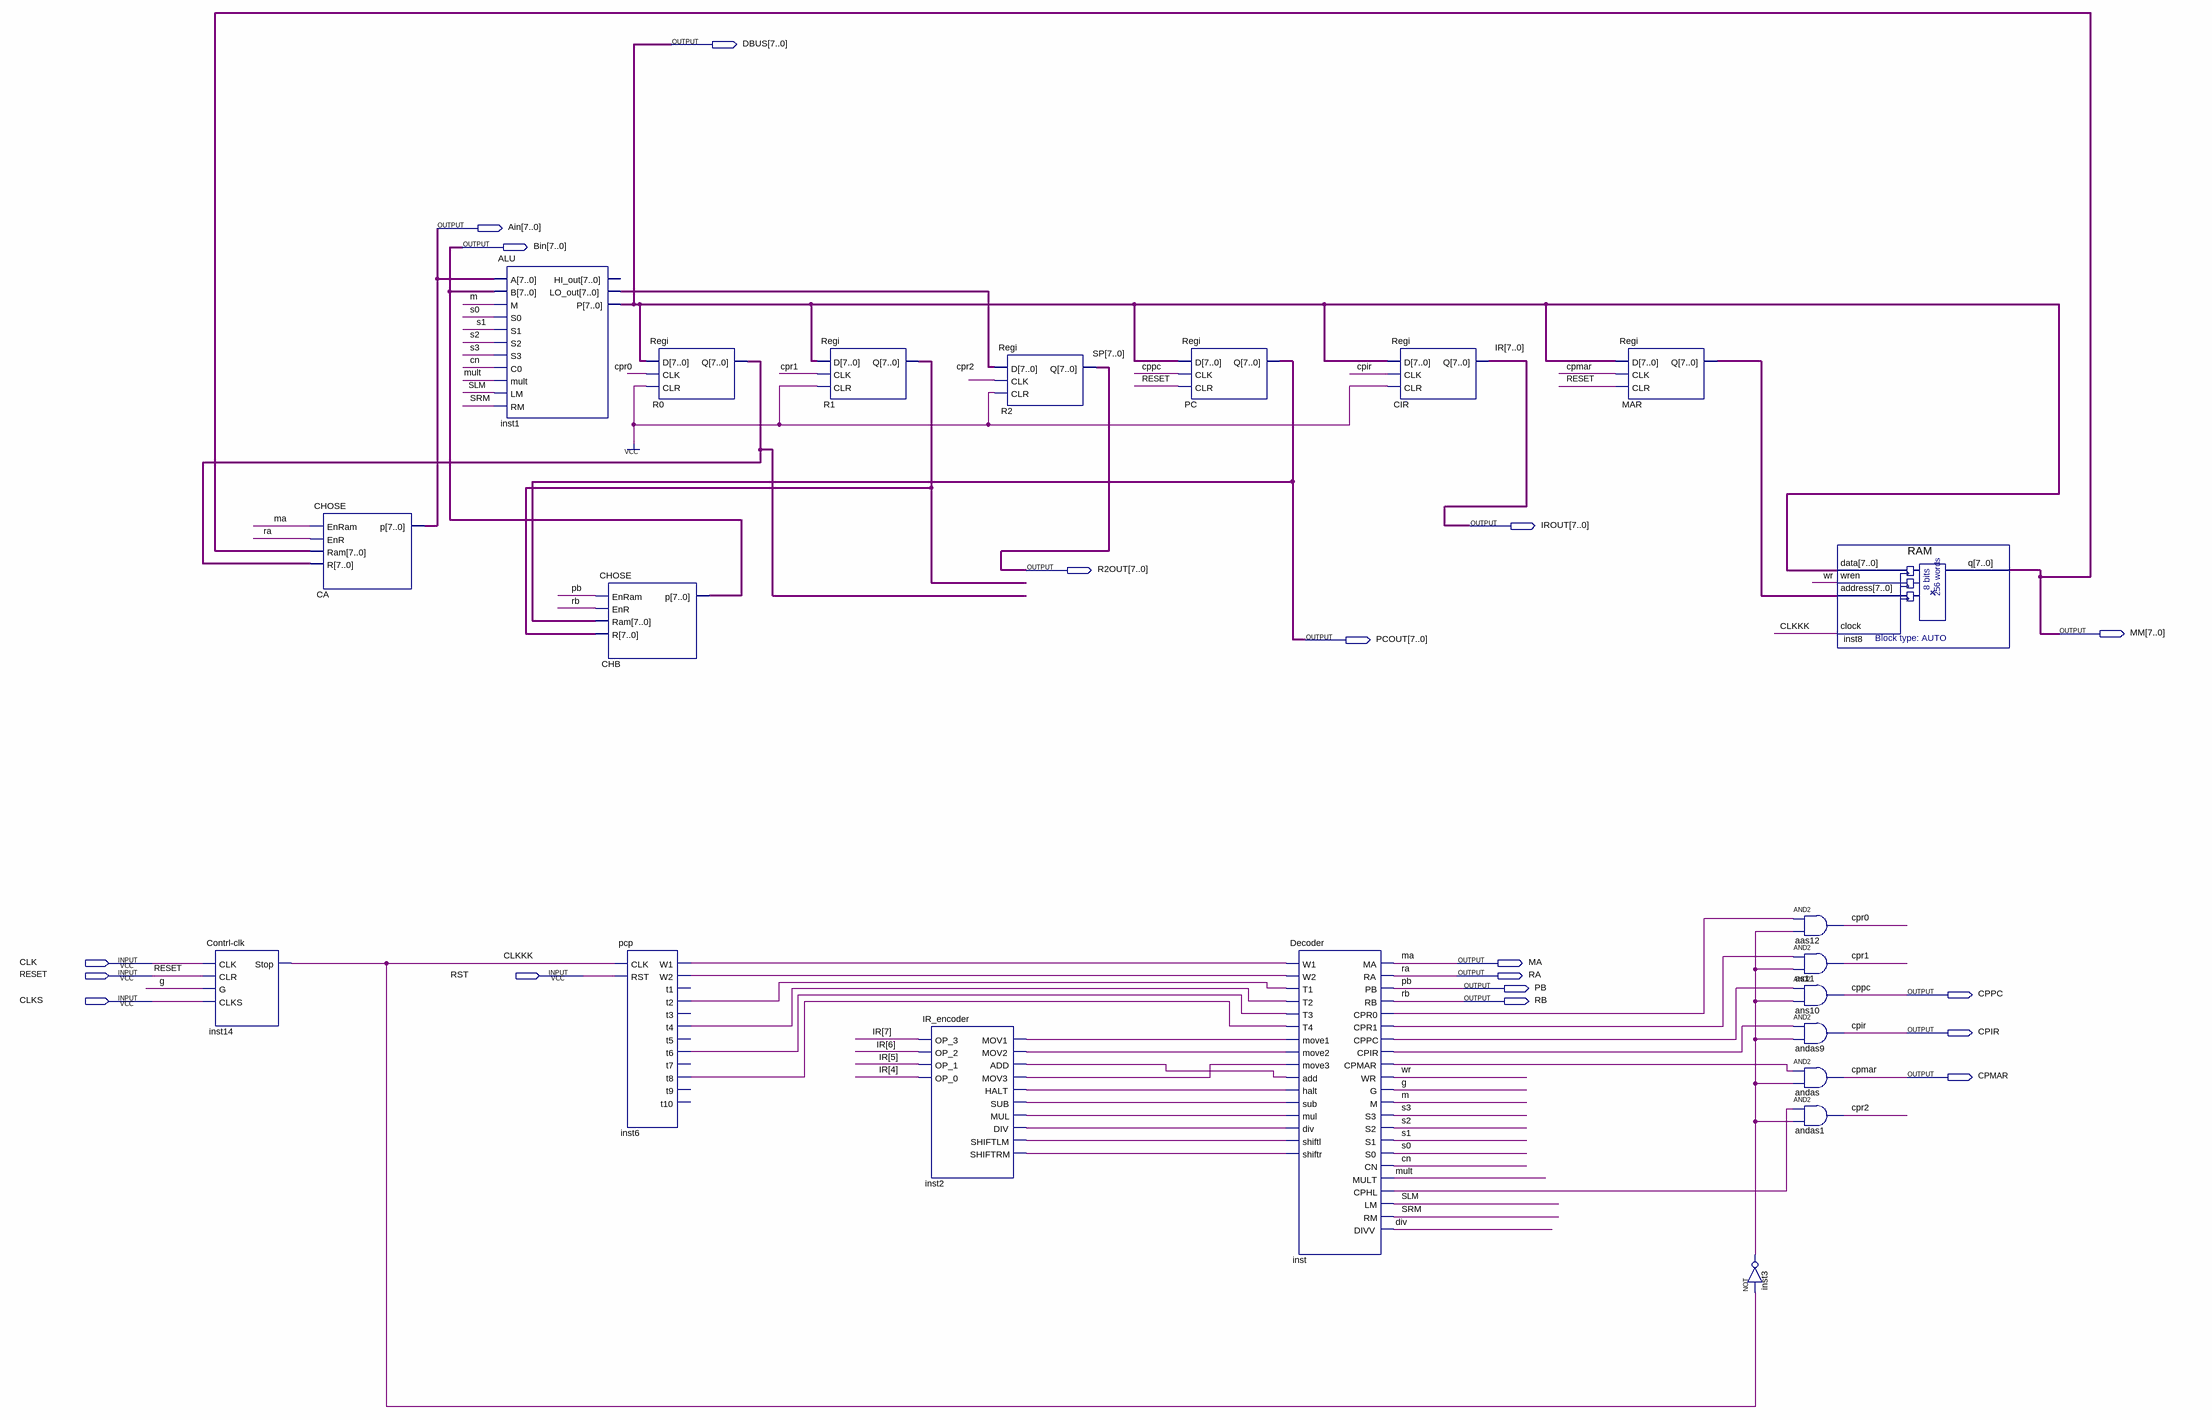
[diagram p0: schematic sheet]
// Quartus schematic lab44.bdf as structural Verilog: 21 symbols, 18 pins
module lab44 (
  input  CLK,
  input  RESET,
  input  RST,
  input  CLKS,
  output [7:0] DBUS,
  output [7:0] Ain,
  output [7:0] Bin,
  output [7:0] IROUT,
  output [7:0] R2OUT,
  output [7:0] MM,
  output [7:0] PCOUT,
  output MA,
  output RA,
  output PB,
  output CPPC,
  output RB,
  output CPIR,
  output CPMAR
);

  wire CLKKK, cn, cpr0, cpr1, cpr2, div, g, inst2_add, inst2_div, inst2_halt, inst2_mov1, inst2_mov2,
       inst2_mov3, inst2_mul, inst2_shiftlm, inst2_shiftrm, inst2_sub, inst3_out, inst6_t2, inst6_t4,
       inst6_t6, inst6_t8, inst6_w1, inst6_w2, inst_cphl, inst_cpir, inst_cpmar, inst_cppc, inst_cpr0,
       inst_cpr1, m, mult, s0, s1, s2, s3, SLM, SRM, wr;
  wire [7:0] inst1_lo_out, MAR_q, R0_q, R1_q;

  \Contrl-clk  inst14 (.CLK(CLK), .CLR(RESET), .G(g), .CLKS(CLKS), .Stop(CLKKK));
  CHOSE CA (.EnRam(MA), .EnR(RA), .Ram(MM), .R(R0_q), .p(Ain));
  ALU inst1 (
    .A(Ain), .B(Bin), .M(m), .S0(s0), .S1(s1), .S2(s2), .S3(s3), .C0(cn), .mult(mult), .LM(SLM), .RM(SRM),
    .LO_out(inst1_lo_out), .P(DBUS));  // open: HI_out
  CHOSE CHB (.EnRam(PB), .EnR(RB), .Ram(PCOUT), .R(R1_q), .p(Bin));
  pcp inst6 (
    .CLK(CLKKK), .RST(RST), .W1(inst6_w1), .W2(inst6_w2), .t2(inst6_t2), .t4(inst6_t4), .t6(inst6_t6),
    .t8(inst6_t8));  // open: t1, t3, t5, t7, t9, t10
  Regi R0 (.D(DBUS), .CLK(cpr0), .CLR(1'b1), .Q(R0_q));
  Regi R1 (.D(DBUS), .CLK(cpr1), .CLR(1'b1), .Q(R1_q));
  IR_encoder inst2 (
    .OP_3(IROUT[7]), .OP_2(IROUT[6]), .OP_1(IROUT[5]), .OP_0(IROUT[4]), .MOV1(inst2_mov1), .MOV2(inst2_mov2),
    .ADD(inst2_add), .MOV3(inst2_mov3), .HALT(inst2_halt), .SUB(inst2_sub), .MUL(inst2_mul), .DIV(inst2_div),
    .SHIFTLM(inst2_shiftlm), .SHIFTRM(inst2_shiftrm));
  Regi R2 (.D(inst1_lo_out), .CLK(cpr2), .CLR(1'b1), .Q(R2OUT));
  Regi PC (.D(DBUS), .CLK(CPPC), .CLR(RESET), .Q(PCOUT));
  Decoder inst (
    .W1(inst6_w1), .W2(inst6_w2), .T1(inst6_t2), .T2(inst6_t4), .T3(inst6_t6), .T4(inst6_t8),
    .move1(inst2_mov1), .move2(inst2_mov2), .move3(inst2_mov3), .add(inst2_add), .halt(inst2_halt),
    .sub(inst2_sub), .mul(inst2_mul), .div(inst2_div), .shiftl(inst2_shiftlm), .shiftr(inst2_shiftrm),
    .MA(MA), .RA(RA), .PB(PB), .RB(RB), .CPR0(inst_cpr0), .CPR1(inst_cpr1), .CPPC(inst_cppc),
    .CPIR(inst_cpir), .CPMAR(inst_cpmar), .WR(wr), .G(g), .M(m), .S3(s3), .S2(s2), .S1(s1), .S0(s0), .CN(cn),
    .MULT(mult), .CPHL(inst_cphl), .LM(SLM), .RM(SRM), .DIVV(div));
  Regi CIR (.D(DBUS), .CLK(CPIR), .CLR(1'b1), .Q(IROUT));
  Regi MAR (.D(DBUS), .CLK(CPMAR), .CLR(RESET), .Q(MAR_q));
  not inst3 (inst3_out, CLKKK);
  and aas12 (cpr0, inst_cpr0, inst3_out);
  and as11 (cpr1, inst_cpr1, inst3_out);
  and ans10 (CPPC, inst_cppc, inst3_out);
  and andas9 (CPIR, inst_cpir, inst3_out);
  and andas (CPMAR, inst_cpmar, inst3_out);
  and andas1 (cpr2, inst_cphl, inst3_out);
  RAM inst8 (.data(DBUS), .wren(wr), .address(MAR_q), .clock(CLKKK), .q(MM));

  // Other names for the same wires on the sheet: IR[7:0] = IROUT; SP[7:0] = R2OUT
endmodule
